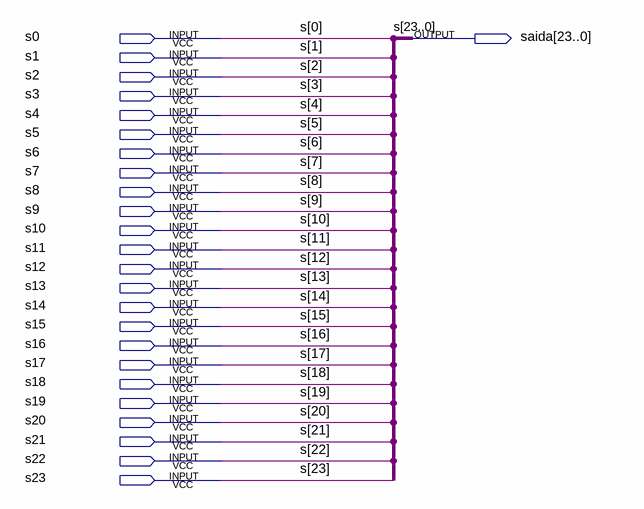
[diagram p0: schematic sheet]
// Quartus schematic 24_to_1.bdf as structural Verilog: 0 symbols, 25 pins
module \24_to_1  (
  input  s0,
  input  s1,
  input  s2,
  input  s3,
  input  s4,
  input  s5,
  input  s6,
  input  s7,
  input  s8,
  input  s9,
  input  s10,
  input  s11,
  input  s12,
  input  s13,
  input  s14,
  input  s15,
  input  s16,
  input  s17,
  input  s18,
  input  s19,
  input  s20,
  input  s21,
  input  s22,
  input  s23,
  output [23:0] saida
);


  assign saida = {s23, s22, s21, s20, s19, s18, s17, s16, s15, s14, s13, s12, s11, s10, s9, s8, s7, s6, s5, s4, s3, s2, s1, s0};
endmodule
